# EAGLE design ITG3200_Gyroscope (EAGLE 7.4.0)
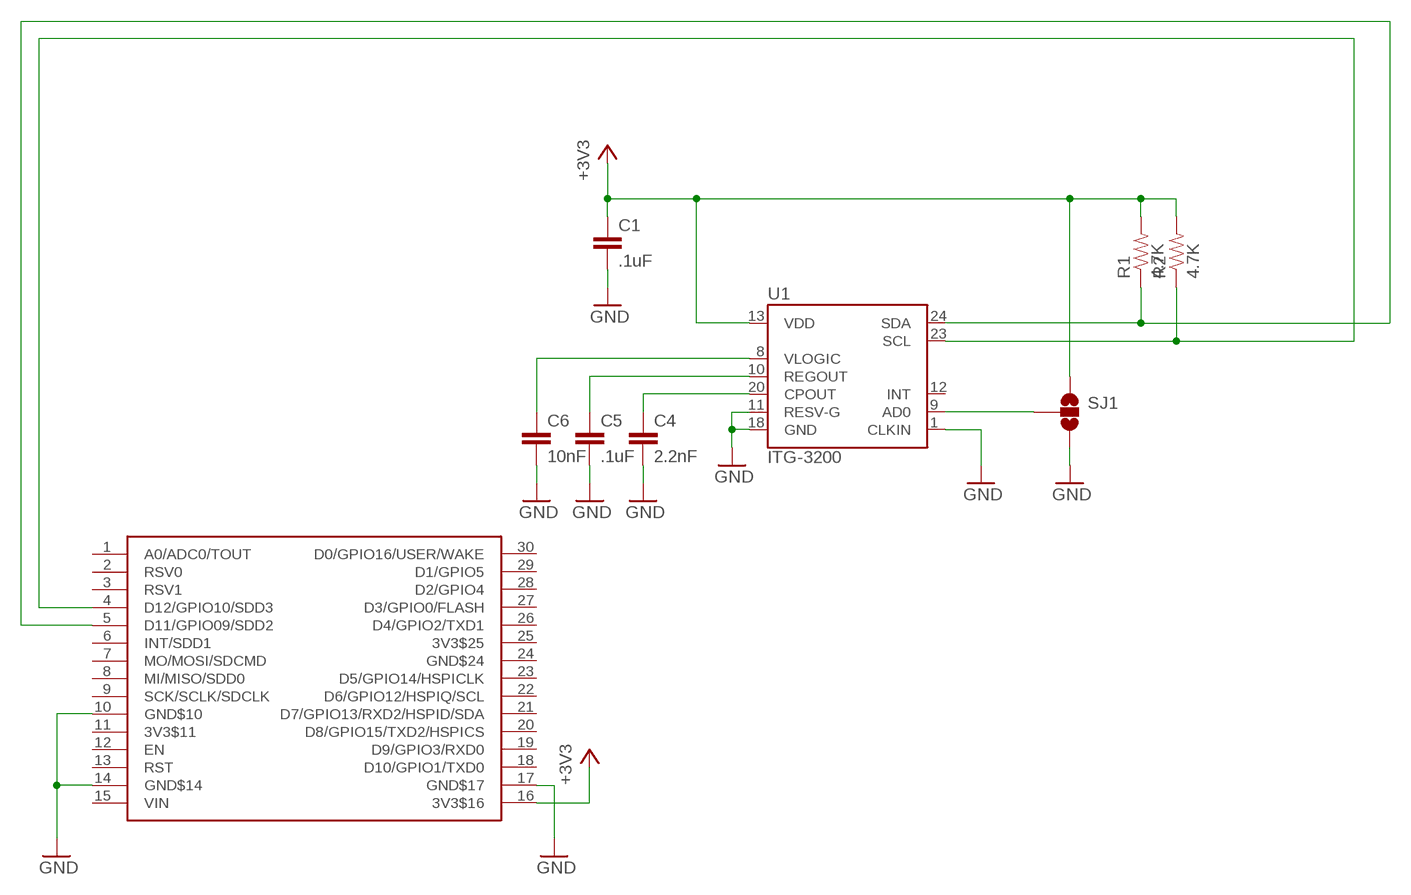
[diagram p0: schematic, sheet 1]

## Parts
C1  .1uF  CAP0603-CAP  [0603-CAP]
C4  2.2nF  CAP0402-CAP  [0402-CAP]
C5  .1uF  CAP0402-CAP  [0402-CAP]
C6  10nF  CAP0402-CAP  [0402-CAP]
R1  4.7K  RESISTOR0402-RES  [0402-RES]
R2  4.7K  RESISTOR0402-RES  [0402-RES]
SJ1  SOLDERJUMPER_2WAYT  [SJ_2]
U1  ITG-3200  [QFN-24]
U$2  NERDSHIELD  [NERDUINO_STACK]

## Nets
+3V3: C1.1 R1.2 R2.2 SJ1.1 U1.13(VDD) U$2.16(3V3$16)
GND: C1.2 C4.2 C5.2 C6.2 SJ1.3 U1.1(CLKIN) U1.11(RESV-G) U1.18(GND) U$2.10(GND$10) U$2.14(GND$14) U$2.17(GND$17)
N$1: SJ1.2 U1.9(AD0)
N$2: R1.1 U1.24(SDA) U$2.5(D11/GPIO09/SDD2)
N$5: R2.1 U1.23(SCL) U$2.4(D12/GPIO10/SDD3)
N$6: C4.1 U1.20(CPOUT)
N$7: C5.1 U1.10(REGOUT)
N$8: C6.1 U1.8(VLOGIC)
Unconnected: U1.12(INT) U$2.1(A0/ADC0/TOUT) U$2.2(RSV0) U$2.3(RSV1) U$2.6(INT/SDD1) U$2.7(MO/MOSI/SDCMD) U$2.8(MI/MISO/SDD0) U$2.9(SCK/SCLK/SDCLK) U$2.11(3V3$11) U$2.12(EN) U$2.13(RST) U$2.15(VIN) U$2.18(D10/GPIO1/TXD0) U$2.19(D9/GPIO3/RXD0) U$2.20(D8/GPIO15/TXD2/HSPICS) U$2.21(D7/GPIO13/RXD2/HSPID/SDA) U$2.22(D6/GPIO12/HSPIQ/SCL) U$2.23(D5/GPIO14/HSPICLK) U$2.24(GND$24) U$2.25(3V3$25) U$2.26(D4/GPIO2/TXD1) U$2.27(D3/GPIO0/FLASH) U$2.28(D2/GPIO4) U$2.29(D1/GPIO5) U$2.30(D0/GPIO16/USER/WAKE)

## Library data of the parts
C1 C4-C6 = SparkFun:CAP: Capacitor Standard 0603 ceramic capacitor, and 0.1" leaded capacitor.
R1 R2 = SparkFun:RESISTOR: Resistor Basic schematic elements and footprints for 0603, 1206, and PTH resistors.
SJ1 = SparkFun:SOLDERJUMPER_2WAY: Solder Jumper 2 way solder jumper
U1 = SparkFun:ITG-3200: ITG-3200 3-axis gyro, digital output, qfn24 package
U$2 = NerduinoShieldLib:NERDSHIELD

## Board
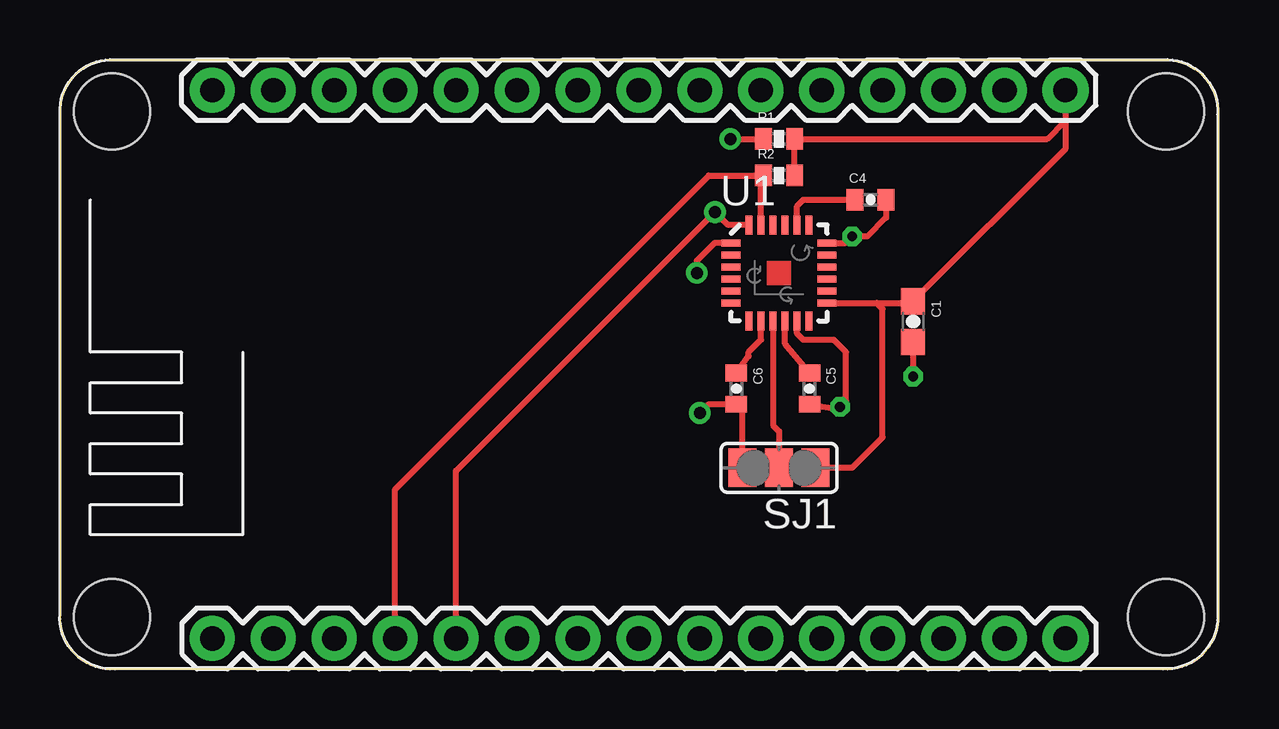
[diagram p1: board, top side]
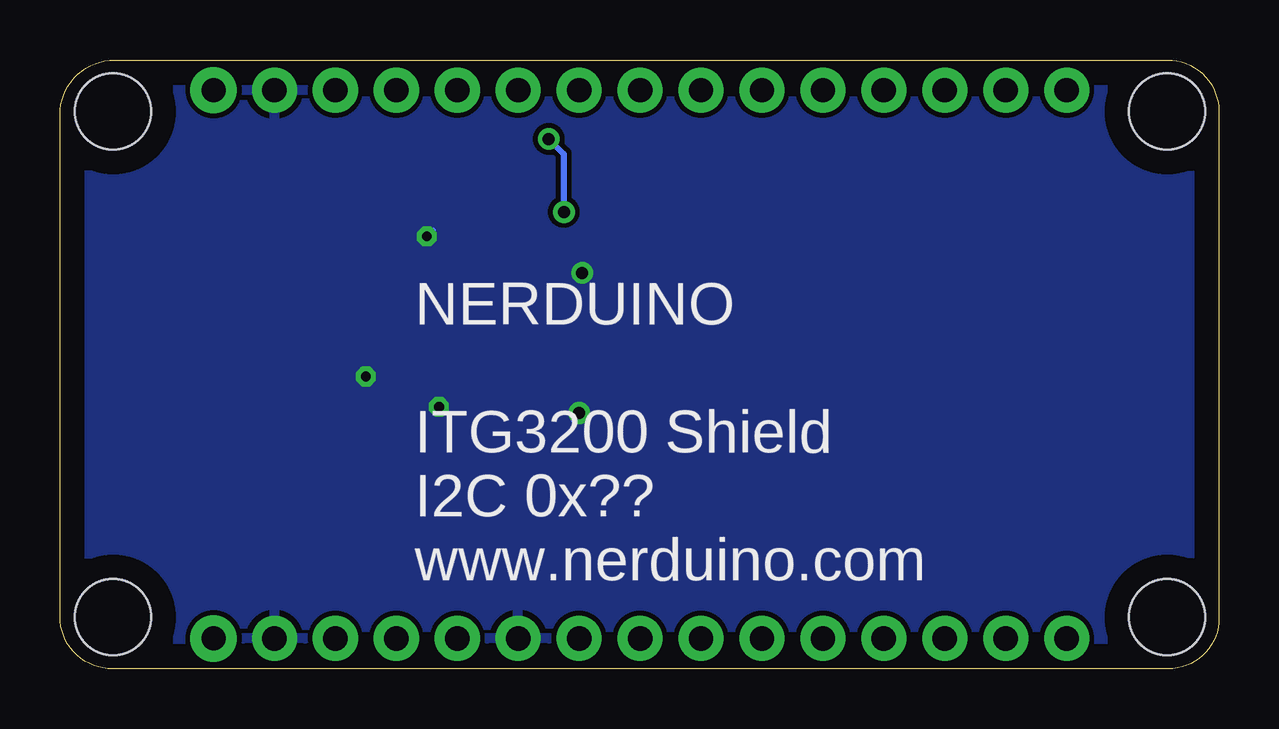
[diagram p2: board, bottom side, seen from below]

Size 48.31 x 25.39 mm. Coordinates in mm from the lower left corner, seen from the top.
Outline: 2.11,0 46.13,0 arc90 48.31,2.18 48.31,23.1 arc90 46.03,25.39 2.15,25.39 arc90 0,23.24 0,2.11 arc90 2.11,0
Copper layers (1*16): Top 0.035mm / dielectric 1.5mm / Bottom 0.035mm
Design rules "default": minimum track width 10mil, minimum drill 24mil, track to track 8mil, track to pad 8mil, pad to pad 8mil, via to via 8mil, smd to smd 8mil, copper to edge 40mil, drill to drill 8mil, minimum pad ring 10mil, minimum via ring 8mil, stop-mask expansion 4mil, vias tented up to drill 0mil, thermal gap 10mil

### Footprints (pad centres in the part's own frame; a part is rotated, then mirrored left to right if it is on the bottom)
0603-CAP = smd 1.1 x 1: 1 -0.85,0; 2 0.85,0
0402-CAP = smd 0.7 x 0.9: 1 -0.65,0; 2 0.65,0
0402-RES = smd 0.7 x 0.9: 1 -0.65,0; 2 0.65,0
SJ_2 = smd 1.168 x 1.6: 1 -1.524,0; 2 0,0; 3 1.524,0
QFN-24 = smd 0.8 x 0.3: 1 -2,1.25; 2 -2,0.75; 3 -2,0.25; 4 -2,-0.25; 5 -2,-0.75; 6 -2,-1.25; 13 2,-1.25; 14 2,-0.75; 15 2,-0.25; 16 2,0.25; 17 2,0.75; 18 2,1.25 | smd 0.3 x 0.8: 7 -1.25,-2; 8 -0.75,-2; 9 -0.25,-2; 10 0.25,-2; 11 0.75,-2; 12 1.25,-2; 19 1.25,2; 20 0.75,2; 21 0.25,2; 22 -0.25,2; 23 -0.75,2; 24 -1.25,2
NERDUINO_STACK = drill 1.016 pad 1.88: 1 -17.78,-5.08; 2 -15.24,-5.08; 3 -12.7,-5.08; 4 -10.16,-5.08; 5 -7.62,-5.08; 6 -5.08,-5.08; 7 -2.54,-5.08; 8 0,-5.08; 9 2.54,-5.08; 10 5.08,-5.08; 11 7.62,-5.08; 12 10.16,-5.08; 13 12.7,-5.08; 14 15.24,-5.08; 17 15.24,17.78; 18 12.7,17.78; 19 10.16,17.78; 20 7.62,17.78; 21 5.08,17.78; 22 2.54,17.78; 23 0,17.78; 24 -2.54,17.78; 25 -5.08,17.78; 26 -7.62,17.78; 27 -10.16,17.78; 28 -12.7,17.78; 29 -15.24,17.78; 30 -17.78,17.78 | drill 1 pad 1.93: 15 17.78,-5.08; 16 17.78,17.78 | hole 3.175: -21.971,16.891; -21.971,-4.191; 21.971,-4.191; 21.971,16.891

### Placement (x,y rotation side)
C1  35.56,14.48 270 top
C4  33.78,19.56 0 top
C5  31.24,11.68 270 top
C6  28.19,11.68 270 top
R1  29.97,22.1 0 top
R2  29.97,20.57 0 top
SJ1  29.97,8.38 180 top
U1  29.97,16.51 0 top
U$2  24.13,6.35 0 top

### Tracks (layer width: path | path; a pad name or v marks a point on that pad's centre or on a via)
+3V3
  Top 0.254: U1.13 34.04,15.26 | 34.04,15.26 35.49,15.26 C1.1 41.91,21.68 41.91,22.86 | U$2.16 41.91,22.86 | 34.04,15.26 34.29,15.01 34.29,9.65 33.02,8.38 SJ1.1 | R2.2 R1.2 41.15,22.1 41.91,22.86
GND  (via drill 0.41 pad 0.41, 0.5)
  Top 0.254: U1.18 32.75,17.76 v33.02,18.03 33.66,18.03 34.43,18.81 C4.2 | U1.11 30.72,13.98 30.99,13.72 32.26,13.72 32.77,13.21 32.77,11.18 v32.51,10.92 32.42,10.83 C5.2 | C1.2 v35.56,12.19 | SJ1.3 28.45,10.78 C6.2 27.04,11.03 v26.67,10.67 | U1.1 27.29,17.76 26.54,17.02 v26.54,16.51
  Bottom 0.254: v33.02,18.03 32.77,18.29 | v32.51,10.92 32.77,10.92 | v35.56,12.19 35.81,12.19 | v26.67,10.67 26.92,10.41 | v26.54,16.51 26.42,16.51 26.29,16.64
  pour Bottom: 0.13,25.15 48.13,25.15 48.13,0.25 0.13,0.25
N$1
  Top 0.254: U1.9 29.72,10.16 29.97,9.91 SJ1.2
N$2  (via drill 0.5)
  Top 0.254: U$2.5 16.51,8.26 v27.3,19.05 27.84,18.51 U1.24 | v27.94,22.1 R1.1
  Bottom 0.254: v27.3,19.05 27.3,21.46 v27.94,22.1
N$5
  Top 0.254: U1.23 29.22,20.32 | 29.22,20.32 29.22,20.47 R2.1 | U$2.4 13.97,7.49 27.05,20.57 28.97,20.57 29.22,20.32
N$6
  Top 0.254: U1.20 30.72,19.29 30.99,19.56 C4.1
N$7
  Top 0.254: U1.10 30.22,13.55 C5.1
N$8
  Top 0.254: U1.8 29.22,13.73 28.7,13.21 28.7,13.04 C6.1

### Text on the board
_bsilk: NERDUINO / / ITG3200 Shield / I2C 0x?? / www.nerduino.com